# EAGLE design M206C (EAGLE 6.6.0)
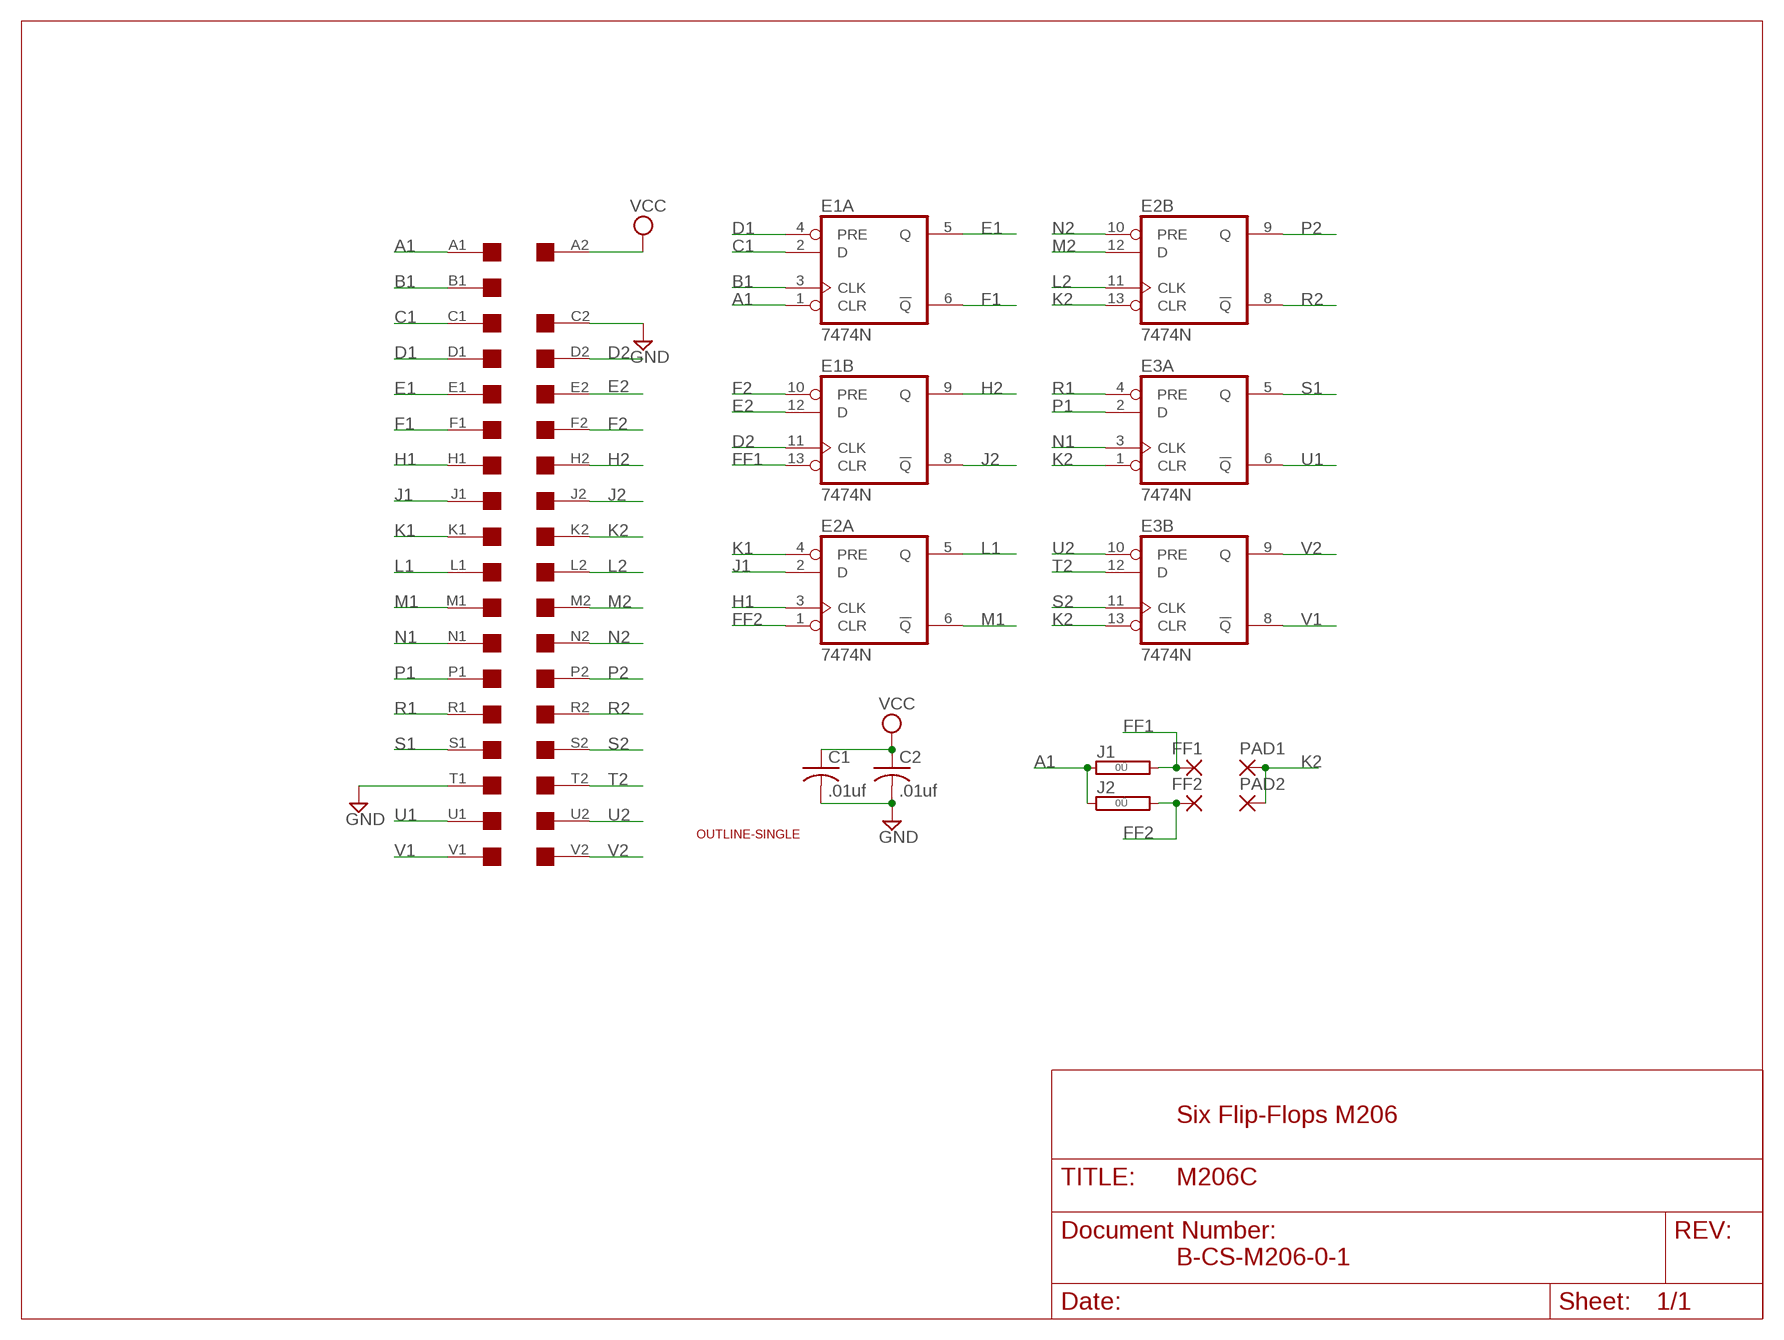
[diagram p0: schematic, sheet 1]

## Parts
C1  .01uf  C-US050-025X075  [C050-025X075]
C2  .01uf  C-US050-025X075  [C050-025X075]
E1  7474N  74S74N  [DIL14]
E2  7474N  74S74N  [DIL14]
E3  7474N  74S74N  [DIL14]
FF1  1,6/0,8  [1,6/0,8]
FF2  1,6/0,8  [1,6/0,8]
J1  0R  [0R/10]
J2  0R  [0R/10]
PAD1  1,6/0,8  [1,6/0,8]
PAD2  1,6/0,8  [1,6/0,8]
U$1  OUTLINE-SINGLE  [SINGLE]
U$4  SINGLE  [EDGE-CON2]

## Nets
A1: E1.1(A:CLR) J1.1 J2.1 U$4.A1
B1: E1.3(A:CLK) U$4.B1
C1: E1.2(A:D) U$4.C1
D1: E1.4(A:PRE) U$4.D1
D2: E1.11(B:CLK) U$4.D2
E1: E1.5(A:Q) U$4.E1
E2: E1.12(B:D) U$4.E2
F1: E1.6(A:!Q) U$4.F1
F2: E1.10(B:PRE) U$4.F2
FF1: E1.13(B:CLR) FF1.1(P) J1.2
FF2: E2.1(A:CLR) FF2.1(P) J2.2
GND [Supply]: C1.2 C2.2 U$4.C2 U$4.T1
H1: E2.3(A:CLK) U$4.H1
H2: E1.9(B:Q) U$4.H2
J1: E2.2(A:D) U$4.J1
J2: E1.8(B:!Q) U$4.J2
K1: E2.4(A:PRE) U$4.K1
K2: E2.13(B:CLR) E3.1(A:CLR) E3.13(B:CLR) PAD1.1(P) PAD2.1(P) U$4.K2
L1: E2.5(A:Q) U$4.L1
L2: E2.11(B:CLK) U$4.L2
M1: E2.6(A:!Q) U$4.M1
M2: E2.12(B:D) U$4.M2
N1: E3.3(A:CLK) U$4.N1
N2: E2.10(B:PRE) U$4.N2
P1: E3.2(A:D) U$4.P1
P2: E2.9(B:Q) U$4.P2
R1: E3.4(A:PRE) U$4.R1
R2: E2.8(B:!Q) U$4.R2
S1: E3.5(A:Q) U$4.S1
S2: E3.11(B:CLK) U$4.S2
T2: E3.12(B:D) U$4.T2
U1: E3.6(A:!Q) U$4.U1
U2: E3.10(B:PRE) U$4.U2
V1: E3.8(B:!Q) U$4.V1
V2: E3.9(B:Q) U$4.V2
VCC [Supply]: C1.1 C2.1 U$4.A2
Unconnected: U$4.B2

## Notes on the sheet
- Six Flip-Flops M206
- B-CS-M206-0-1

## Power pins joined to a net without a drawn wire
GND: E1.7(P:GND) E2.7(P:GND) E3.7(P:GND)
VCC: E1.14(P:VCC) E2.14(P:VCC) E3.14(P:VCC)

## Library data of the parts
C1 C2 = rcl:C-US: CAPACITOR, American symbol
E1-E3 = 74xx-us:74*74: Dual D type positive edge triggered FLIP FLOP, preset and clear
FF1 FF2 PAD1 PAD2 = wirepad:1,6/0,8: THROUGH-HOLE PAD
J1 J2 = jumper:0R: Bridge 0R 10mm
U$1 = dec-con:OUTLINE-*: Board outlines for DEC boards.
U$4 = dec-con:SINGLE: Single-Height DEC board

## Net classes
1 Supply: width 0.813 mm

## Board
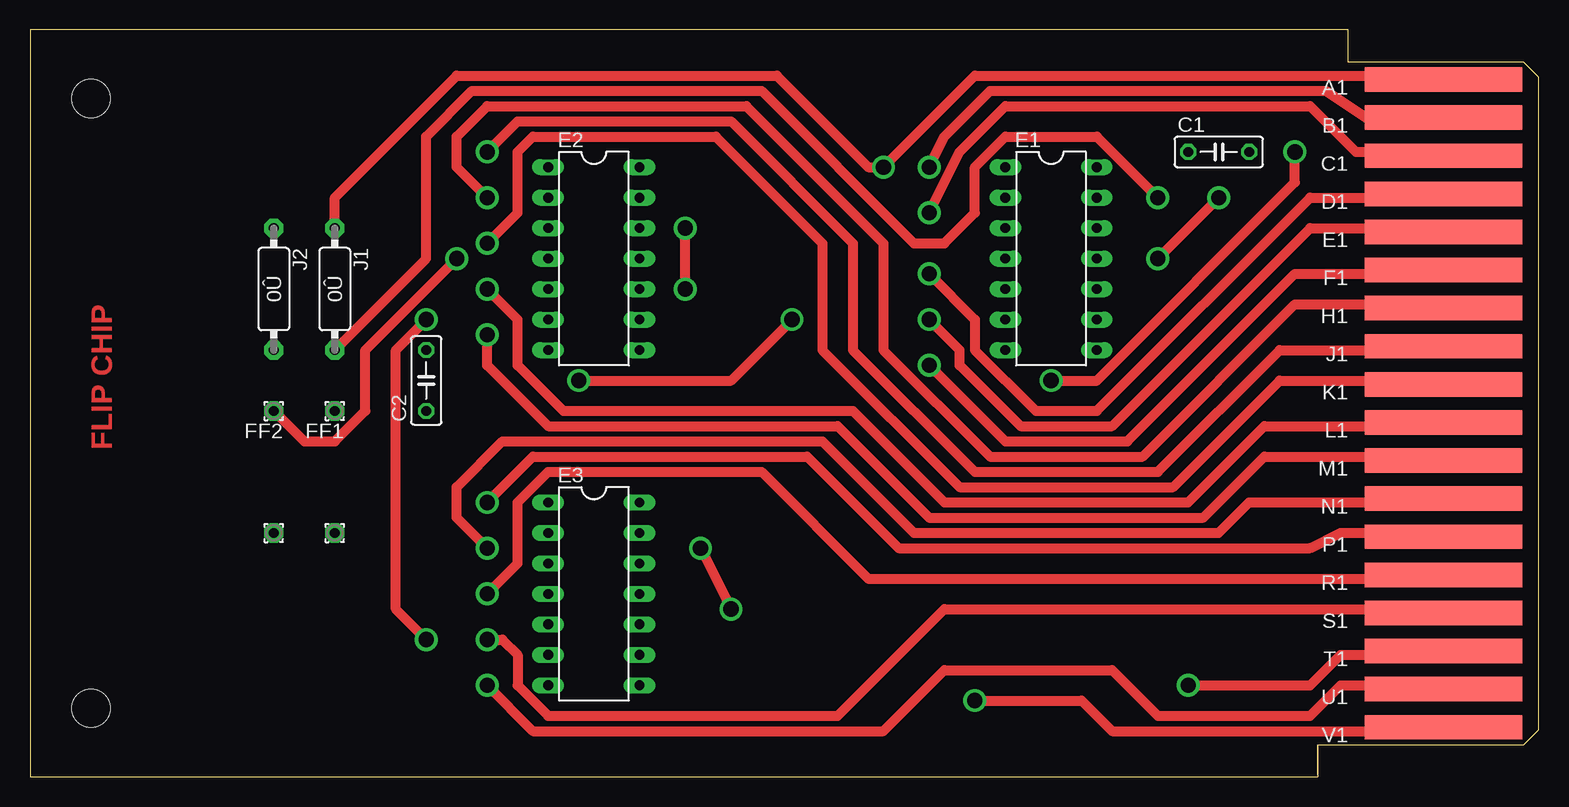
[diagram p1: board, top side]
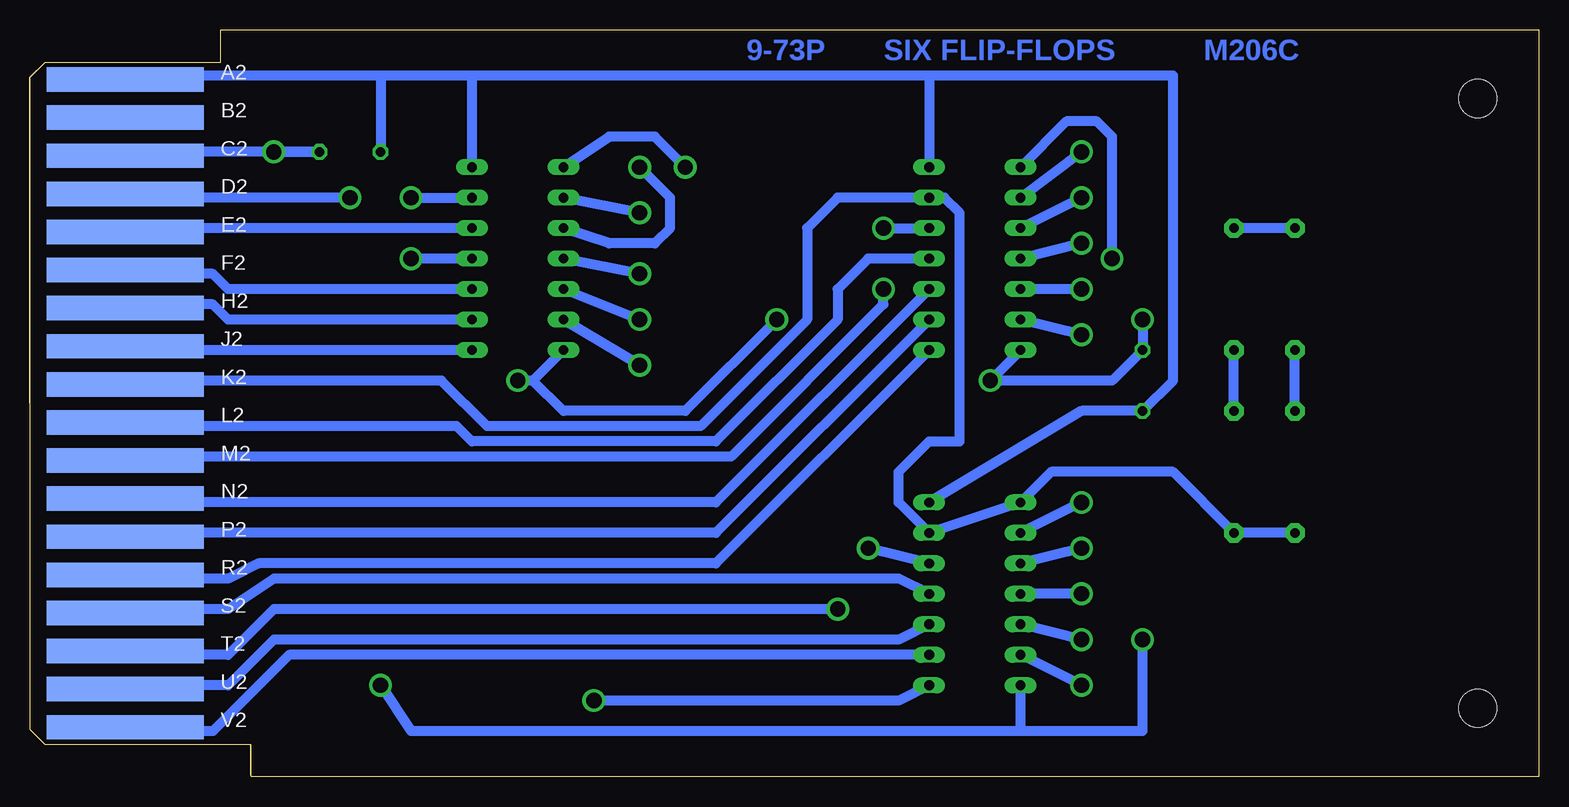
[diagram p2: board, bottom side, seen from below]

Size 125.73 x 62.23 mm. Coordinates in mm from the lower left corner, seen from the top.
Copper layers (1+16): Top 0.035mm / dielectric 1.5mm / Bottom 0.035mm
Design rules "16mils": minimum track width 16mil, minimum drill 32mil, track to track 15mil, track to pad 10mil, pad to pad 10mil, via to via 10mil, smd to smd 10mil, copper to edge 13mil, drill to drill 10mil, minimum pad ring 10mil, minimum via ring 8mil, stop-mask expansion 0mil, vias tented up to drill 0mil, thermal gap 10mil

### Footprints (pad centres in the part's own frame; a part is rotated, then mirrored left to right if it is on the bottom)
C050-025X075 = drill 0.813 octagon: 1 -2.54,0; 2 2.54,0
DIL14 = drill 0.813 long: 1 -7.62,-3.81; 2 -5.08,-3.81; 3 -2.54,-3.81; 4 0,-3.81; 5 2.54,-3.81; 6 5.08,-3.81; 7 7.62,-3.81; 8 7.62,3.81; 9 5.08,3.81; 10 2.54,3.81; 11 0,3.81; 12 -2.54,3.81; 13 -5.08,3.81; 14 -7.62,3.81
1,6/0,8 = drill 0.813 pad 1.6 octagon: 1 0,0
0R/10 = drill 0.813 pad 1.6 octagon: 1 -5.08,0; 2 5.08,0
SINGLE = hole 3.175: 120.65,56.515; 120.65,5.715
EDGE-CON2 = smd 13.106 x 2.032: A1 7.938,4.128; B1 7.938,7.303; C1 7.938,10.477; D1 7.938,13.652; E1 7.938,16.828; F1 7.938,20.003; H1 7.938,23.177; J1 7.938,26.352; K1 7.938,29.527; L1 7.938,32.703; M1 7.938,35.877; N1 7.938,39.053; P1 7.938,42.227; R1 7.938,45.403; S1 7.938,48.578; T1 7.938,51.752; U1 7.938,54.928; V1 7.938,58.102 | smd 13.106 x 2.032 bottom: A2 7.938,4.128; B2 7.938,7.303; C2 7.938,10.477; D2 7.938,13.652; E2 7.938,16.828; F2 7.938,20.003; H2 7.938,23.177; J2 7.938,26.352; K2 7.938,29.527; L2 7.938,32.703; M2 7.938,35.877; N2 7.938,39.053; P2 7.938,42.227; R2 7.938,45.403; S2 7.938,48.578; T2 7.938,51.752; U2 7.938,54.928; V2 7.938,58.102

### Placement (x,y rotation side)
C1  99.06,52.07 0 top
C2  33.02,33.02 90 top
E1  85.09,43.18 270 top
E2  46.99,43.18 270 top
E3  46.99,15.24 270 top
FF1  25.4,30.48 180 top
FF2  20.32,30.48 180 top
J1  25.4,40.64 270 top
J2  20.32,40.64 270 top
PAD1  25.4,20.32 180 top
PAD2  20.32,20.32 180 top
U$1  125.73,62.23 180 top
U$4  125.73,62.23 180 top

### Tracks (layer width: path | path; a pad name or v marks a point on that pad's centre or on a via)
A1  (via drill 1.27)
  Top 0.813: U$4.A1 111.76,58.42 78.74,58.42 v71.12,50.8 69.85,50.8 62.23,58.42 35.56,58.42 25.4,48.26 J1.1
  Bottom 0.813: E1.1 77.47,53.34 73.66,53.34 v71.12,50.8 | J2.1 J1.1
B1  (via drill 1.27)
  Top 0.813: U$4.B1 111.76,54.61 107.95,57.15 80.01,57.15 76.2,53.34 v74.93,50.8
  Bottom 0.813: E1.3 77.47,44.45 73.66,44.45 72.39,45.72 72.39,48.26 v74.93,50.8
C1  (via drill 1.27)
  Top 0.813: U$4.C1 111.76,52.07 110.49,52.07 106.68,55.88 81.28,55.88 77.47,52.07 v74.93,46.99
  Bottom 0.813: v74.93,46.99 E1.2
D1  (via drill 1.27)
  Top 0.813: U$4.D1 112.06,48.56 111.76,48.26 106.68,48.26 88.9,30.48 83.82,30.48 78.74,35.56 78.74,38.1 v74.93,41.91
  Bottom 0.813: v74.93,41.91 E1.4
D2  (via drill 1.27)
  Top 0.813: v93.98,43.18 v99.06,48.26
  Bottom 0.813: E1.11 v93.98,43.18 | U$4.D2 112.06,48.56 111.76,48.26 v99.06,48.26
E1  (via drill 1.27)
  Top 0.813: U$4.E1 112.09,45.39 111.76,45.72 106.68,45.72 90.17,29.21 82.55,29.21 77.47,34.29 77.47,35.56 v74.93,38.1
  Bottom 0.813: v74.93,38.1 E1.5
E2
  Bottom 0.813: U$4.E2 112.09,45.39 111.76,45.72 E1.12
F1  (via drill 1.27)
  Top 0.813: U$4.F1 112.04,42.19 111.76,41.91 105.41,41.91 91.44,27.94 81.28,27.94 v74.93,34.29
  Bottom 0.813: v74.93,34.29 E1.6
F2
  Bottom 0.813: U$4.F2 112.04,42.19 111.76,41.91 110.49,41.91 109.22,40.64 E1.10
FF1  (via drill 1.27)
  Top 0.813: v93.98,48.26 88.9,53.34 81.28,53.34 78.74,50.8 78.74,46.99 76.2,44.45 73.66,44.45 60.96,57.15 36.83,57.15 33.02,53.34 33.02,43.18 J1.2
  Bottom 0.813: v93.98,48.26 E1.13 | FF1.1 J1.2
FF2  (via drill 1.27)
  Top 0.813: FF2.1 22.86,27.94 25.4,27.94 27.94,30.48 27.94,35.56 v35.56,43.18
  Bottom 0.813: FF2.1 J2.2 | E2.1 39.37,54.61 36.83,54.61 35.56,53.34 v35.56,43.18
GND  (via drill 1.27)
  Top 0.813: v105.41,52.07 105.41,49.53 88.9,33.02 v85.09,33.02 | v45.72,33.02 58.42,33.02 v63.5,38.1 | v33.02,38.1 30.48,35.56 30.48,13.97 v33.02,11.43 | U$4.T1 112.09,10.49 111.76,10.16 109.22,10.16 106.68,7.62 v96.52,7.62
  Bottom 0.813: U$4.C2 111.76,52.07 C1.2 v105.41,52.07 | E2.7 v45.72,33.02 35.56,33.02 C2.2 v33.02,38.1 | 83.82,33.02 v85.09,33.02 | 83.82,33.02 E1.7 | v63.5,38.1 71.12,30.48 81.28,30.48 83.82,33.02 | v33.02,11.43 33.02,3.81 43.18,3.81 | 43.18,3.81 E3.7 | 43.18,3.81 93.98,3.81 v96.52,7.62
H1  (via drill 1.27)
  Top 0.813: U$4.H1 112.09,39.04 111.76,39.37 105.41,39.37 92.71,26.67 80.01,26.67 71.12,35.56 71.12,44.45 59.69,55.88 38.1,55.88 35.56,53.34 35.56,50.8 v38.1,48.26
  Bottom 0.813: v38.1,48.26 E2.3
H2
  Bottom 0.813: U$4.H2 112.09,39.04 111.76,39.37 110.49,39.37 109.22,38.1 E1.9
J1  (via drill 1.27)
  Top 0.813: U$4.J1 112.09,35.89 111.76,35.56 104.14,35.56 93.98,25.4 78.74,25.4 68.58,35.56 68.58,44.45 58.42,54.61 40.64,54.61 v38.1,52.07
  Bottom 0.813: v38.1,52.07 E2.2
J2
  Bottom 0.813: U$4.J2 112.09,35.89 111.76,35.56 E1.8
K1  (via drill 1.27)
  Top 0.813: U$4.K1 112.06,32.72 111.76,33.02 104.14,33.02 95.25,24.13 77.47,24.13 66.04,35.56 66.04,44.45 57.15,53.34 41.91,53.34 40.64,52.07 40.64,46.99 v38.1,44.45
  Bottom 0.813: v38.1,44.45 E2.4
K2
  Bottom 0.813: PAD2.1 PAD1.1 30.48,25.4 40.64,25.4 E3.1 E3.13 53.34,22.86 53.34,25.4 50.8,27.94 48.26,27.94 48.26,46.99 49.53,48.26 E2.13 58.42,48.26 60.96,45.72 60.96,38.1 69.85,29.21 87.63,29.21 91.44,33.02 111.76,33.02 112.06,32.72 U$4.K2
L1  (via drill 1.27)
  Top 0.813: U$4.L1 112.09,29.54 111.76,29.21 102.87,29.21 96.52,22.86 76.2,22.86 68.58,30.48 44.45,30.48 40.64,34.29 40.64,38.1 v38.1,40.64
  Bottom 0.813: v38.1,40.64 E2.5
L2
  Bottom 0.813: U$4.L2 111.76,29.21 90.17,29.21 88.9,27.94 68.58,27.94 58.42,38.1 58.42,40.64 55.88,43.18 E2.11
M1  (via drill 1.27)
  Top 0.813: U$4.M1 112.09,26.34 111.76,26.67 102.87,26.67 97.79,21.59 74.93,21.59 67.31,29.21 43.18,29.21 38.1,34.29 v38.1,36.83
  Bottom 0.813: v38.1,36.83 E2.6
M2  (via drill 1.27)
  Top 0.813: v54.61,40.64 v54.61,45.72
  Bottom 0.813: v54.61,45.72 E2.12 | U$4.M2 111.76,26.67 67.31,26.67 54.61,39.37 v54.61,40.64
N1  (via drill 1.27)
  Top 0.813: U$4.N1 111.76,22.86 101.6,22.86 99.06,20.32 73.66,20.32 66.04,27.94 39.37,27.94 35.56,24.13 35.56,21.59 v38.1,19.05
  Bottom 0.813: v38.1,19.05 E3.3
N2
  Bottom 0.813: U$4.N2 111.76,22.86 68.58,22.86 E2.10
P1  (via drill 1.27)
  Top 0.813: U$4.P1 111.76,20.32 109.22,20.32 106.68,19.05 72.39,19.05 64.77,26.67 41.91,26.67 v38.1,22.86
  Bottom 0.813: v38.1,22.86 E3.2
P2
  Bottom 0.813: U$4.P2 111.76,20.32 68.58,20.32 E2.9
R1  (via drill 1.27)
  Top 0.813: U$4.R1 111.76,16.51 69.85,16.51 60.96,25.4 43.18,25.4 40.64,22.86 40.64,17.78 v38.1,15.24
  Bottom 0.813: v38.1,15.24 E3.4
R2
  Bottom 0.813: U$4.R2 111.76,16.51 109.22,16.51 106.68,17.78 68.58,17.78 E2.8
S1  (via drill 1.27)
  Top 0.813: U$4.S1 111.76,13.97 76.2,13.97 67.31,5.08 43.18,5.08 40.64,7.62 40.64,10.16 39.37,11.43 v38.1,11.43
  Bottom 0.813: v38.1,11.43 E3.5
S2
  Bottom 0.813: U$4.S2 111.76,13.97 109.22,13.97 105.41,16.51 53.34,16.51 E3.11
T2  (via drill 1.27)
  Top 0.813: v55.88,19.05 v58.42,13.97
  Bottom 0.813: U$4.T2 111.76,10.16 109.22,10.16 105.41,13.97 v58.42,13.97 | E3.12 v55.88,19.05
U1  (via drill 1.27)
  Top 0.813: U$4.U1 111.76,7.62 109.22,7.62 106.68,5.08 93.98,5.08 90.17,8.89 76.2,8.89 71.12,3.81 41.91,3.81 v38.1,7.62
  Bottom 0.813: v38.1,7.62 E3.6
U2
  Bottom 0.813: U$4.U2 111.76,7.62 109.22,7.62 105.41,11.43 53.34,11.43 E3.10
V1  (via drill 1.27)
  Top 0.813: U$4.V1 111.76,3.81 90.17,3.81 87.63,6.35 v78.74,6.35
  Bottom 0.813: E3.8 53.34,6.35 v78.74,6.35
V2
  Bottom 0.813: U$4.V2 111.76,3.81 110.49,3.81 104.14,10.16 E3.9
VCC
  Bottom 0.813: U$4.A2 112.16,58.02 111.76,58.42 96.52,58.42 | 50.8,58.42 88.9,58.42 | 88.9,58.42 96.52,58.42 | 50.8,58.42 E2.14 | 88.9,58.42 E1.14 | 96.52,58.42 C1.1 | 50.8,58.42 30.48,58.42 30.48,33.02 C2.1 38.1,30.48 E3.14

### Text on the board
Top: FLIP CHIP
Bottom: M206C | SIX FLIP-FLOPS | 9-73P
tValues: A1 | K2